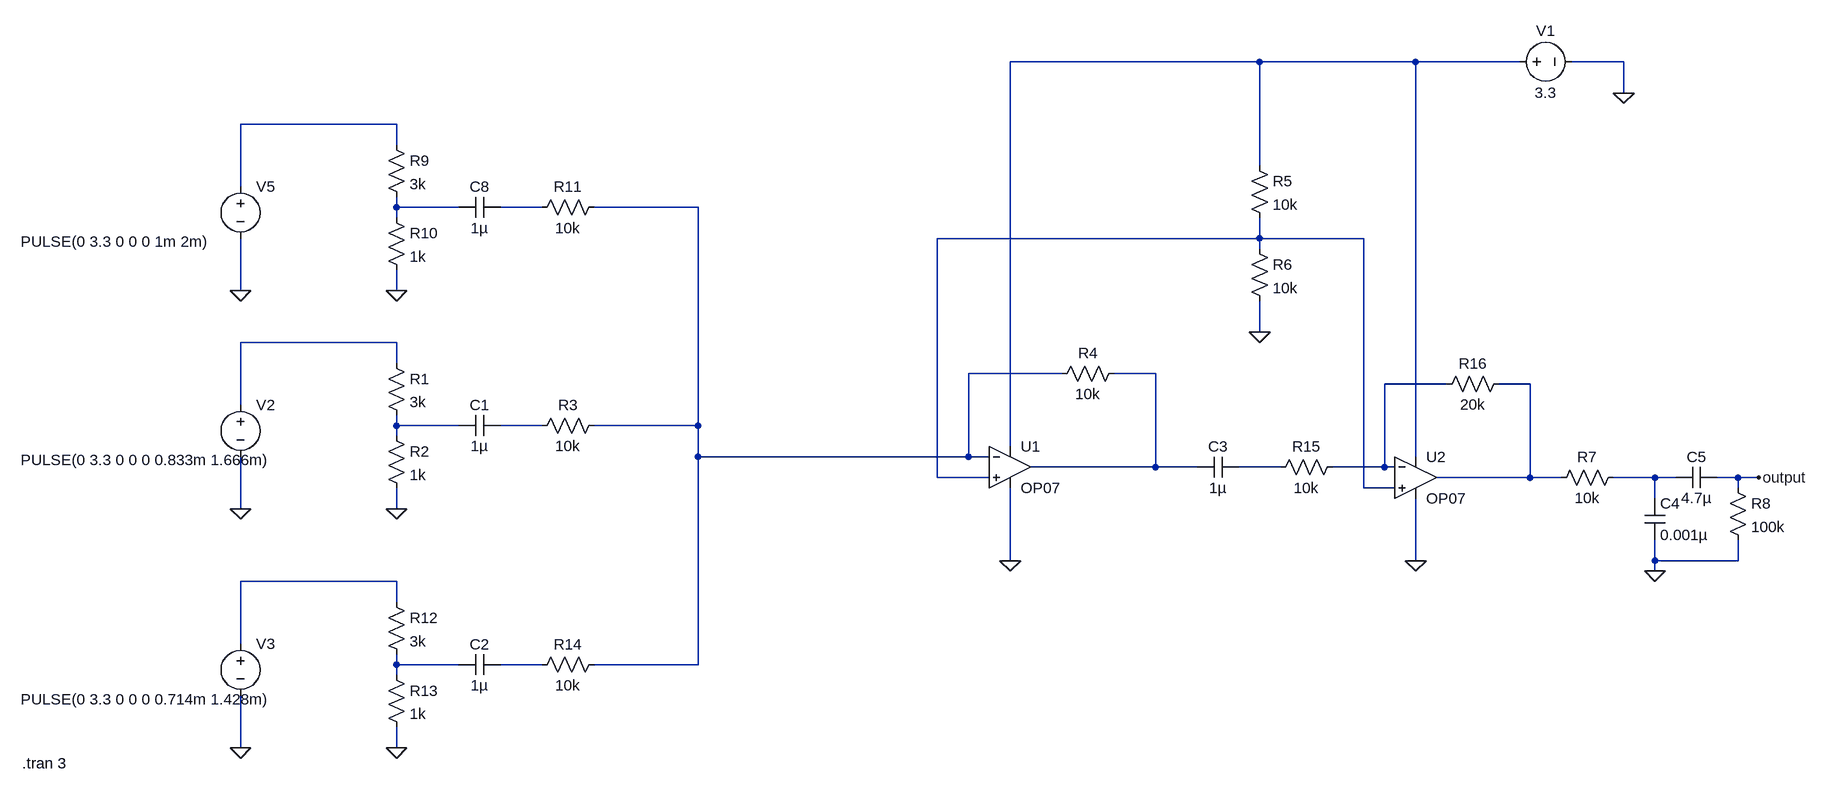
[diagram p0: schematic mixer_circuit.asc]
mixer_circuit.asc, the LTspice schematic file:
Version 4
SHEET 1 1600 680
WIRE 736 -960 352 -960
WIRE 976 -960 736 -960
WIRE 1136 -960 976 -960
WIRE 1296 -960 1216 -960
WIRE 1296 -912 1296 -960
WIRE -592 -864 -832 -864
WIRE -592 -832 -592 -864
WIRE 736 -800 736 -960
WIRE -832 -768 -832 -864
WIRE -592 -736 -592 -752
WIRE -496 -736 -592 -736
WIRE -368 -736 -432 -736
WIRE -128 -736 -288 -736
WIRE -592 -720 -592 -736
WIRE 736 -688 736 -720
WIRE 736 -688 240 -688
WIRE 896 -688 736 -688
WIRE 736 -672 736 -688
WIRE -832 -608 -832 -688
WIRE -592 -608 -592 -640
WIRE 736 -544 736 -592
WIRE -592 -528 -832 -528
WIRE -592 -496 -592 -528
WIRE 432 -480 288 -480
WIRE 576 -480 512 -480
WIRE 1024 -464 928 -464
WIRE 1152 -464 1104 -464
WIRE -832 -432 -832 -528
WIRE -592 -400 -592 -416
WIRE -496 -400 -592 -400
WIRE -368 -400 -432 -400
WIRE -128 -400 -128 -736
WIRE -128 -400 -288 -400
WIRE -592 -384 -592 -400
WIRE 352 -368 352 -960
WIRE -128 -352 -128 -400
WIRE 288 -352 288 -480
WIRE 288 -352 -128 -352
WIRE 320 -352 288 -352
WIRE 976 -352 976 -960
WIRE 576 -336 576 -480
WIRE 576 -336 384 -336
WIRE 640 -336 576 -336
WIRE 768 -336 704 -336
WIRE 928 -336 928 -464
WIRE 928 -336 848 -336
WIRE 944 -336 928 -336
WIRE 240 -320 240 -688
WIRE 320 -320 240 -320
WIRE 1152 -320 1152 -464
WIRE 1152 -320 1008 -320
WIRE 1200 -320 1152 -320
WIRE 1344 -320 1280 -320
WIRE 1376 -320 1344 -320
WIRE 1472 -320 1440 -320
WIRE 1504 -320 1472 -320
WIRE 896 -304 896 -688
WIRE 944 -304 896 -304
WIRE 1472 -304 1472 -320
WIRE 1344 -288 1344 -320
WIRE -832 -272 -832 -352
WIRE -592 -272 -592 -304
WIRE 352 -192 352 -304
WIRE 976 -192 976 -288
WIRE 1344 -192 1344 -224
WIRE 1472 -192 1472 -224
WIRE 1472 -192 1344 -192
WIRE 1344 -176 1344 -192
WIRE -592 -160 -832 -160
WIRE -592 -128 -592 -160
WIRE -832 -64 -832 -160
WIRE -592 -32 -592 -48
WIRE -496 -32 -592 -32
WIRE -368 -32 -432 -32
WIRE -128 -32 -128 -352
WIRE -128 -32 -288 -32
WIRE -592 -16 -592 -32
WIRE -832 96 -832 16
WIRE -592 96 -592 64
FLAG 736 -544 0
FLAG 1296 -912 0
FLAG 352 -192 0
FLAG 1504 -320 output
FLAG 1344 -176 0
FLAG -832 -608 0
FLAG -592 -608 0
FLAG -832 -272 0
FLAG -592 -272 0
FLAG -832 96 0
FLAG -592 96 0
FLAG 976 -192 0
SYMBOL res 528 -496 R90
WINDOW 0 0 56 VBottom 2
WINDOW 3 32 56 VTop 2
SYMATTR InstName R4
SYMATTR Value 10k
SYMBOL OpAmps\\OP07 352 -400 R0
SYMATTR InstName U1
SYMBOL voltage 1120 -960 R270
WINDOW 0 32 56 VTop 2
WINDOW 3 -32 56 VBottom 2
WINDOW 123 0 0 Left 0
WINDOW 39 0 0 Left 0
SYMATTR InstName V1
SYMATTR Value 3.3
SYMBOL res 720 -816 R0
SYMATTR InstName R5
SYMATTR Value 10k
SYMBOL res 720 -688 R0
SYMATTR InstName R6
SYMATTR Value 10k
SYMBOL res 1296 -336 R90
WINDOW 0 0 56 VBottom 2
WINDOW 3 32 56 VTop 2
SYMATTR InstName R7
SYMATTR Value 10k
SYMBOL cap 1328 -288 R0
SYMATTR InstName C4
SYMATTR Value 0.001µ
SYMBOL res 1456 -320 R0
SYMATTR InstName R8
SYMATTR Value 100k
SYMBOL cap 1440 -336 R90
WINDOW 0 0 32 VBottom 2
WINDOW 3 32 32 VTop 2
SYMATTR InstName C5
SYMATTR Value 4.7µ
SYMBOL voltage -832 -784 R0
WINDOW 3 -338 101 Left 2
WINDOW 123 0 0 Left 0
WINDOW 39 0 0 Left 0
SYMATTR Value PULSE(0 3.3 0 0 0 1m 2m)
SYMATTR InstName V5
SYMBOL res -608 -848 R0
SYMATTR InstName R9
SYMATTR Value 3k
SYMBOL res -608 -736 R0
SYMATTR InstName R10
SYMATTR Value 1k
SYMBOL cap -432 -752 R90
WINDOW 0 0 32 VBottom 2
WINDOW 3 32 32 VTop 2
SYMATTR InstName C8
SYMATTR Value 1µ
SYMBOL res -272 -752 R90
WINDOW 0 0 56 VBottom 2
WINDOW 3 32 56 VTop 2
SYMATTR InstName R11
SYMATTR Value 10k
SYMBOL voltage -832 -448 R0
WINDOW 3 -338 101 Left 2
WINDOW 123 0 0 Left 0
WINDOW 39 0 0 Left 0
SYMATTR Value PULSE(0 3.3 0 0 0 0.833m 1.666m)
SYMATTR InstName V2
SYMBOL res -608 -512 R0
SYMATTR InstName R1
SYMATTR Value 3k
SYMBOL res -608 -400 R0
SYMATTR InstName R2
SYMATTR Value 1k
SYMBOL cap -432 -416 R90
WINDOW 0 0 32 VBottom 2
WINDOW 3 32 32 VTop 2
SYMATTR InstName C1
SYMATTR Value 1µ
SYMBOL res -272 -416 R90
WINDOW 0 0 56 VBottom 2
WINDOW 3 32 56 VTop 2
SYMATTR InstName R3
SYMATTR Value 10k
SYMBOL voltage -832 -80 R0
WINDOW 3 -338 101 Left 2
WINDOW 123 0 0 Left 0
WINDOW 39 0 0 Left 0
SYMATTR Value PULSE(0 3.3 0 0 0 0.714m 1.428m)
SYMATTR InstName V3
SYMBOL res -608 -144 R0
SYMATTR InstName R12
SYMATTR Value 3k
SYMBOL res -608 -32 R0
SYMATTR InstName R13
SYMATTR Value 1k
SYMBOL cap -432 -48 R90
WINDOW 0 0 32 VBottom 2
WINDOW 3 32 32 VTop 2
SYMATTR InstName C2
SYMATTR Value 1µ
SYMBOL res -272 -48 R90
WINDOW 0 0 56 VBottom 2
WINDOW 3 32 56 VTop 2
SYMATTR InstName R14
SYMATTR Value 10k
SYMBOL OpAmps\\OP07 976 -384 R0
SYMATTR InstName U2
SYMBOL res 864 -352 R90
WINDOW 0 0 56 VBottom 2
WINDOW 3 32 56 VTop 2
SYMATTR InstName R15
SYMATTR Value 10k
SYMBOL res 1120 -480 R90
WINDOW 0 0 56 VBottom 2
WINDOW 3 32 56 VTop 2
SYMATTR InstName R16
SYMATTR Value 20k
SYMBOL cap 704 -352 R90
WINDOW 0 0 32 VBottom 2
WINDOW 3 32 32 VTop 2
SYMATTR InstName C3
SYMATTR Value 1µ
TEXT -1168 120 Left 2 !.tran 3

The netlist it stands for:
* mixer_circuit.asc
R4 N008 N005 10k
XU1 N006 N005 N001 0 N008 LT1001  ; OP07, pins In+ In- V+ V- OUT
V1 N001 0 3.3
R5 N001 N006 10k
R6 N006 0 10k
R7 N014 N010 10k
C4 N014 0 0.001µ
R8 output 0 100k
C5 output N014 4.7µ
V5 N002 0 PULSE(0 3.3 0 0 0 1m 2m)
R9 N002 N003 3k
R10 N003 0 1k
C8 N004 N003 1µ
R11 N005 N004 10k
V2 N007 0 PULSE(0 3.3 0 0 0 0.833m 1.666m)
R1 N007 N011 3k
R2 N011 0 1k
C1 N012 N011 1µ
R3 N005 N012 10k
V3 N015 0 PULSE(0 3.3 0 0 0 0.714m 1.428m)
R12 N015 N016 3k
R13 N016 0 1k
C2 N017 N016 1µ
R14 N005 N017 10k
XU2 N006 N009 N001 0 N010 LT1001  ; OP07, pins In+ In- V+ V- OUT
R15 N009 N013 10k
R16 N010 N009 20k
C3 N013 N008 1µ
.tran 3
.lib LTC.lib
.backanno
.end